# Altium schematic sheet JCM800-2204.SchDoc
size C
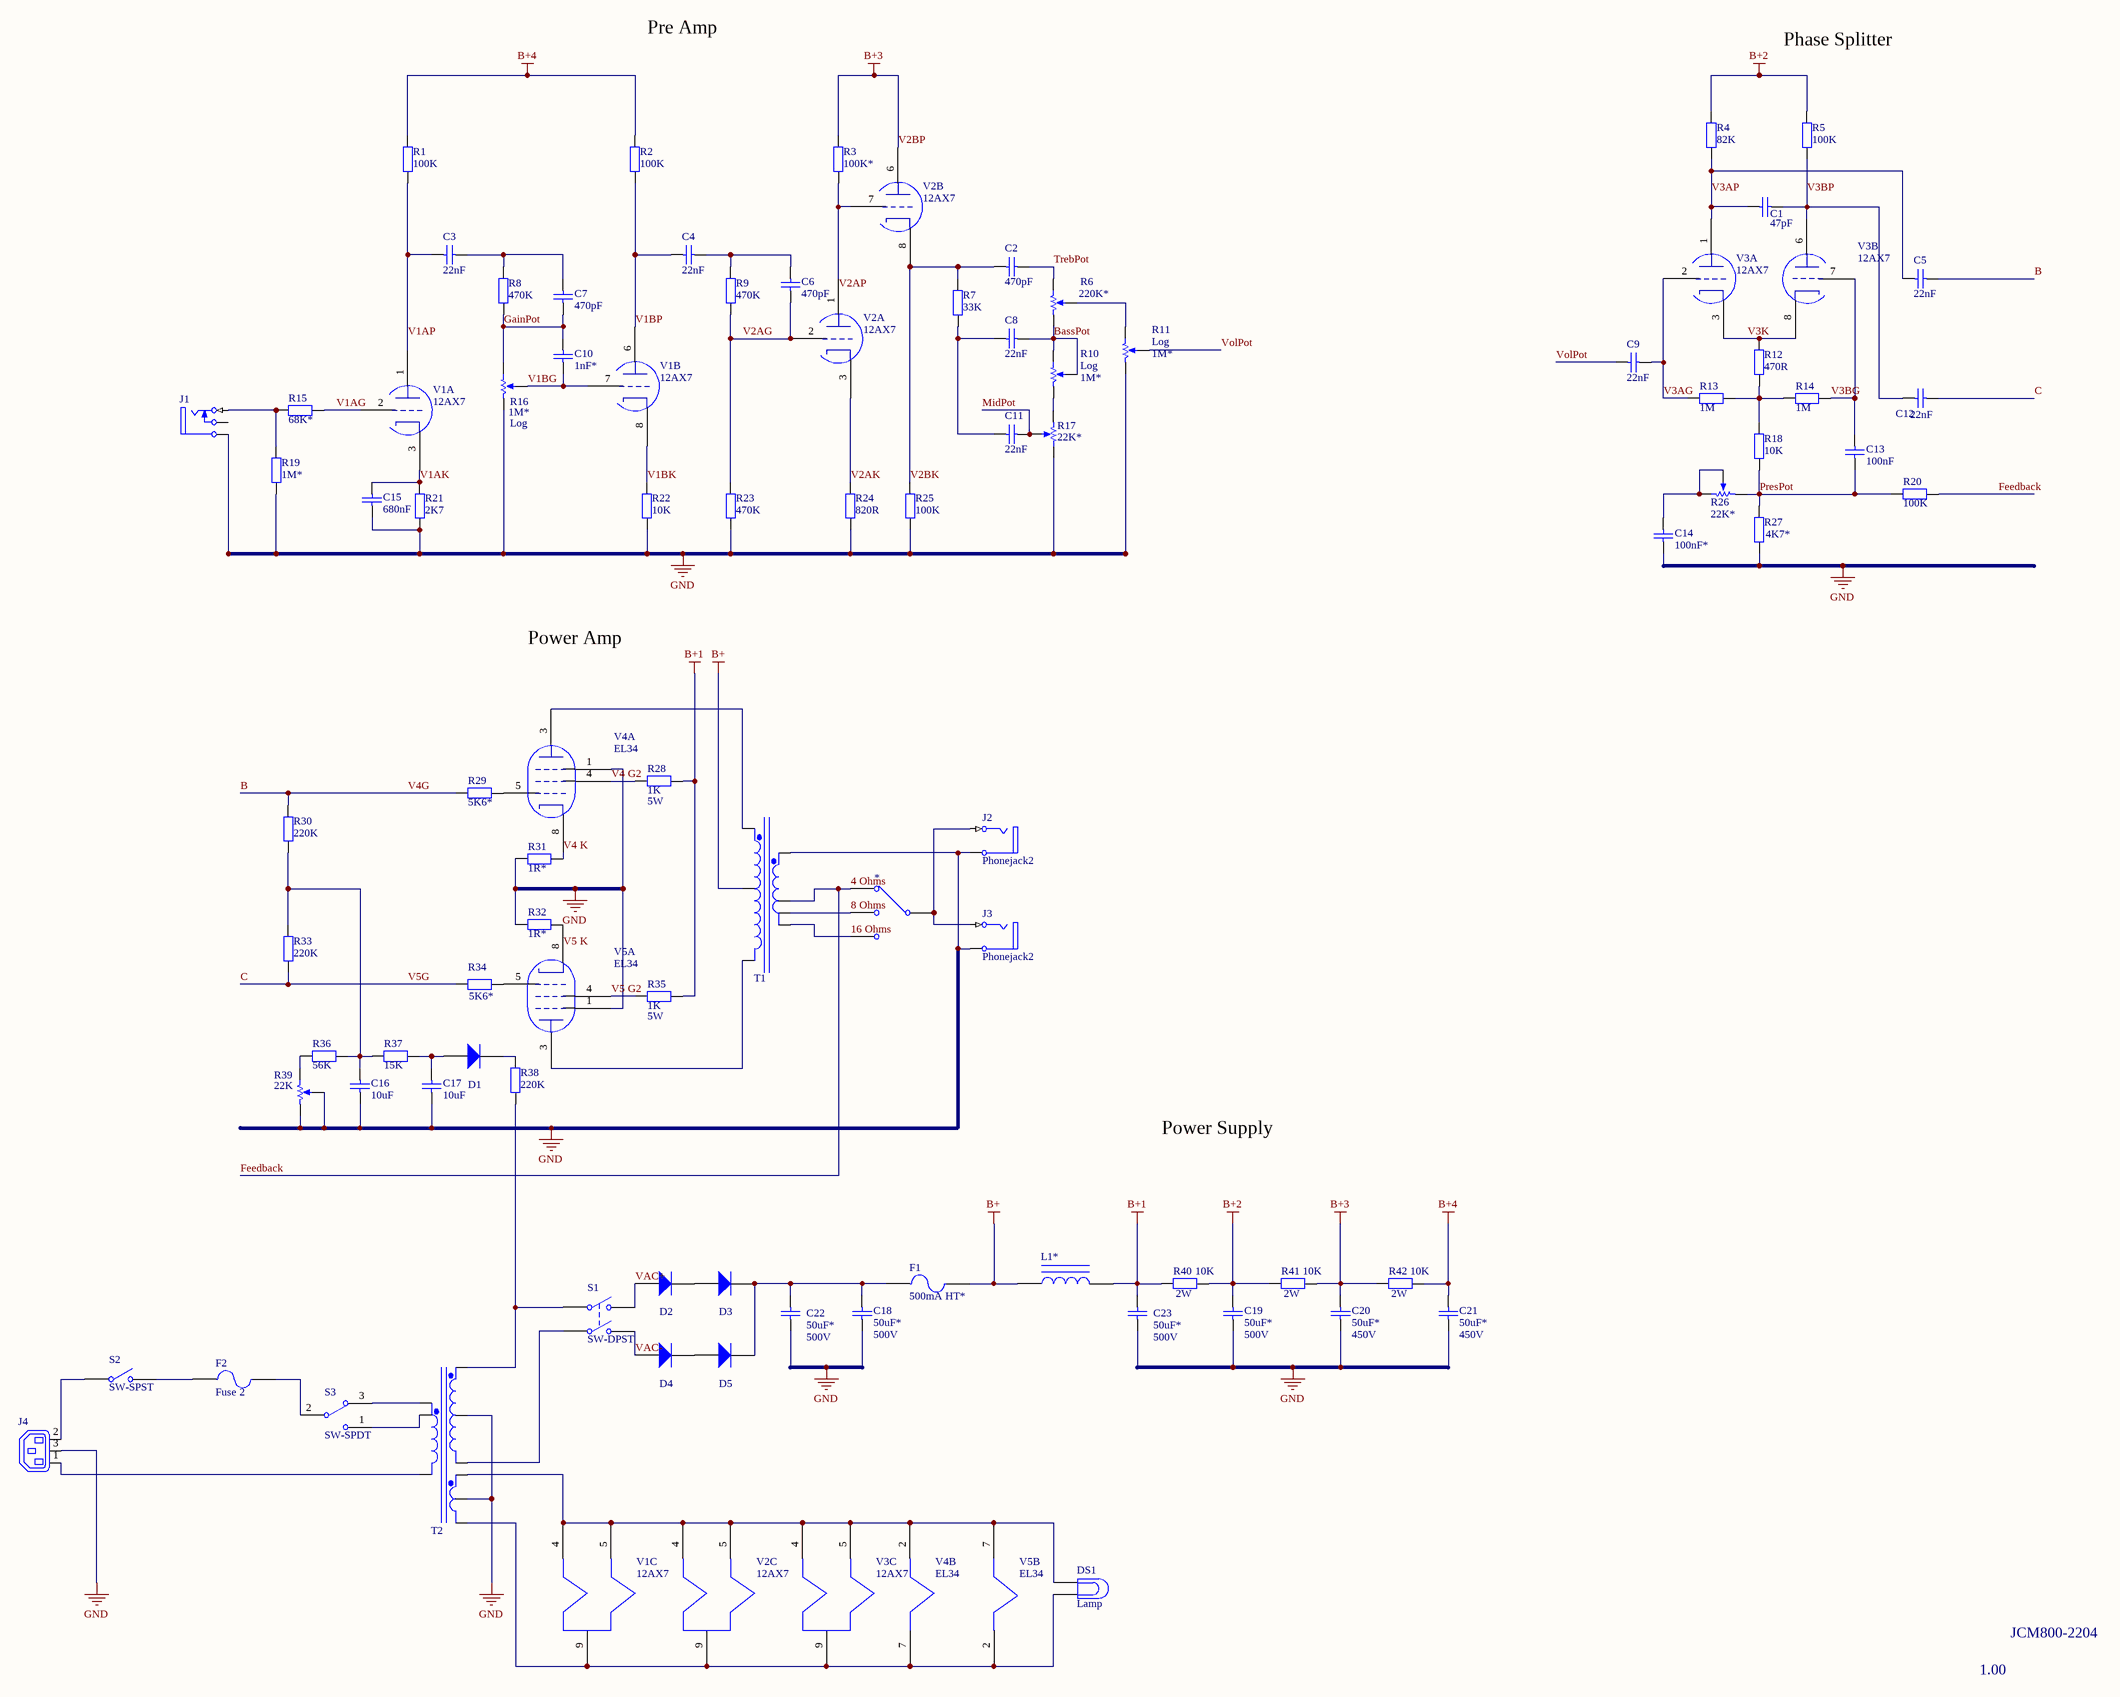
[diagram p0: JCM800-2204.SchDoc]

## Parts
*  Switch 3way  (value not drawn)
C1  value 47pF  [3CM TURRET]  (hidden comment: Cap-cer-RSV-50V-0805)
C2  value 470pF  [6cm Turret]  (hidden comment: Cap-cer-RSV-50V-0805)
C3  value 22nF  [3CM TURRET]  (hidden comment: Cap-cer-RSV-50V-0805)
C4  value 22nF  [3CM TURRET]  (hidden comment: Cap-cer-RSV-50V-0805)
C5  value 22nF  [6CM TURRET]  (hidden comment: Cap-cer-RSV-50V-0805)
C6  value 470pF  (hidden comment: Cap-cer-RSV-50V-0805)
C7  value 470pF  (hidden comment: Cap-cer-RSV-50V-0805)
C8  value 22nF  [6cm Turret]  (hidden comment: Cap-cer-RSV-50V-0805)
C9  value 22nF  [6cm Turret]  (hidden comment: Cap-cer-RSV-50V-0805)
C10  value 1nF*  (hidden comment: Cap-cer-RSV-50V-0805)
C11  value 22nF  [6cm Turret]  (hidden comment: Cap-cer-RSV-50V-0805)
C12  value 22nF  [6CM TURRET]  (hidden comment: Cap-cer-RSV-50V-0805)
C13  value 100nF  [6CM TURRET]  (hidden comment: Cap-cer-RSV-50V-0805)
C14  value 100nF*  (hidden comment: Cap-cer-RSV-50V-0805)
C15  value 680nF  (hidden comment: Cap-cer-RSV-50V-0805)
C16  value 10uF  [6CM TURRET]  (hidden comment: Cap-cer-RSV-50V-0805)
C17  value 10uF  [6CM TURRET]  (hidden comment: Cap-cer-RSV-50V-0805)
C18  value 50uF*  Voltage: 500V  [6cm Turret]  (hidden comment: Cap-cer-RSV-50V-0805)
C19  value 50uF*  Voltage: 500V  [6cm Turret]  (hidden comment: Cap-cer-RSV-50V-0805)
C20  value 50uF*  Voltage: 450V  [6cm Turret]  (hidden comment: Cap-cer-RSV-50V-0805)
C21  value 50uF*  Voltage: 450V  [6cm Turret]  (hidden comment: Cap-cer-RSV-50V-0805)
C22  value 50uF*  Voltage: 500V  (hidden comment: Cap-cer-RSV-50V-0805)
C23  value 50uF*  Voltage: 500V  [6cm Turret]  (hidden comment: Cap-cer-RSV-50V-0805)
D1  1N4148  [3cm Turret]  (value not drawn)
D2  1N4148  [3cm Turret]  (value not drawn)
D3  1N4148  [3cm Turret]  (value not drawn)
D4  1N4148  [3cm Turret]  (value not drawn)
D5  1N4148  [3cm Turret]  (value not drawn)
DS1  Lamp
F1  500mA HT*
F2  Fuse 2
J1  Phonejack2 TN  [JACK/6-V3A]  (value not drawn)
J2  Phonejack2  [JACK/6-V2]
J3  Phonejack2  [JACK/6-V2]
J4  Plug AC Female  (value not drawn)
L1*  Inductor Iron  (value not drawn)
R1  value 100K  [3CM TURRET]  (hidden comment: Res-100K-0805-1%-1/8W)
R2  value 100K  [3CM TURRET]  (hidden comment: Res-100K-0805-1%-1/8W)
R3  value 100K*  (hidden comment: Res-100K-0805-1%-1/8W)
R4  value 82K  [3CM TURRET]  (hidden comment: Res-82K-0805-1%-1/8W)
R5  value 100K  [3CM TURRET]  (hidden comment: Res-100K-0805-1%-1/8W)
R6  value 220K*  (hidden comment: RPot)
R7  value 33K  [3CM TURRET]  (hidden comment: Res-33K-0805-1%-1/8W)
R8  value 470K  [3CM TURRET]  (hidden comment: Res-470K-0805-1%-1/8W)
R9  value 470K  [6CM TURRET]  (hidden comment: Res-470K-0805-1%-1/8W)
R10  Log  value 1M*
R11  Log  value 1M*
R12  value 470R  [3CM TURRET]  (hidden comment: Res-RSV-0805-1%-1/8W)
R13  value 1M  [3CM TURRET]  (hidden comment: Res-1M-0805-1%-1/8W)
R14  value 1M  [3CM TURRET]  (hidden comment: Res-1M-0805-1%-1/8W)
R15  value 68K*  (hidden comment: Res-68K-0805-1%-1/8W)
R16  Log  value 1M*
R17  value 22K*  (hidden comment: RPot)
R18  value 10K  [3CM TURRET]  (hidden comment: Res-10K-0805-1%-1/8W)
R19  value 1M*  (hidden comment: Res-1M-0805-1%-1/8W)
R20  value 100K  [6CM TURRET]  (hidden comment: Res-100K-0805-1%-1/8W)
R21  value 2K7  [6CM TURRET]  (hidden comment: Res-2K7-0805-1%-1/8W)
R22  value 10K  [6CM TURRET]  (hidden comment: Res-10K-0805-1%-1/8W)
R23  value 470K  [6CM TURRET]  (hidden comment: Res-470K-0805-1%-1/8W)
R24  value 820R  [6CM TURRET]  (hidden comment: Res-820R-0805-1%-1/8W)
R25  value 100K  [6CM TURRET]  (hidden comment: Res-100K-0805-1%-1/8W)
R26  value 22K*  (hidden comment: RPot)
R27  value 4K7*  (hidden comment: Res-4K7-0805-1%-1/8W)
R28  value 1K  Watts: 5W  [6cm Turret]  (hidden comment: Res-1K-0805-1%-1/8W)
R29  value 5K6*  (hidden comment: Res-5K6-0805-1%-1/8W)
R30  value 220K  [3CM TURRET]  (hidden comment: Res-150K-0805-1%-1/8W)
R31  value 1R*  (hidden comment: Res-RSV-0805-1%-1/8W)
R32  value 1R*  (hidden comment: Res-RSV-0805-1%-1/8W)
R33  value 220K  [3CM TURRET]  (hidden comment: Res-150K-0805-1%-1/8W)
R34  value 5K6*  (hidden comment: Res-5K6-0805-1%-1/8W)
R35  value 1K  Watts: 5W  [6cm Turret]  (hidden comment: Res-1K-0805-1%-1/8W)
R36  value 56K  [3CM TURRET]  (hidden comment: Res-47K-0805-1%-1/8W)
R37  value 15K  [3CM TURRET]  (hidden comment: Res-15K-0805-1%-1/8W)
R38  value 220K  [3CM TURRET]  (hidden comment: Res-120K-0805-1%-1/8W)
R39  value 22K  [VR5]  (hidden comment: RPot)
R40  value 10K  Watts: 2W  [3cm Turret]  (hidden comment: Res-10K-0805-1%-1/8W)
R41  value 10K  Watts: 2W  [3cm Turret]  (hidden comment: Res-10K-0805-1%-1/8W)
R42  value 10K  Watts: 2W  [3cm Turret]  (hidden comment: Res-10K-0805-1%-1/8W)
S1  SW-DPST
S2  SW-SPST
S3  SW-SPDT
T1  Transformador Saida  (value not drawn)
T2  Transformer  (value not drawn)
V1  12AX7  (parts A,B,C of 3)
V2  12AX7  (parts A,B,C of 3)
V3  12AX7  (parts A,B,C of 3)
V4  EL34  (parts A,B of 2)
V5  EL34  (parts A,B of 2)

## Nets
B+: F1.2 L1*.1 T1.2(Pri-)
B+1: C23.1 L1*.2 R28.2 R35.2 R40.2
B+2: C19.1 R4.2 R5.2 R40.1 R41.2
B+4: C21.1 R1.2 R2.2 R42.1
GND: C14.1 C15.1 C16.2 C17.2 C18.2 C19.2 C20.2 C21.2 C22.2 C23.2 J1.5(S) J2.5(S) J3.5(S) J4.3(E) R11.2(BOT) R16.2(BOT) R17.1(TOP) R19.1 R21.1 R22.1 R23.1 R24.1 R25.1 R27.1 R31.2 R32.2 R39.2(BOT) R39.3(TAP) T1.3(Sec1+) T2.7 T2.8 V4.1(g3) V5.1(g3)
V2BP: C20.1 R3.2 R41.1 R42.2 V2.6(Plate)  [also labelled B+3]
4 Ohms: *.1 R20.1 T1.6(Sec2-)  [also labelled Feedback]
8 Ohms: *.3 T1.5(Sec2+)
16 Ohms: *.1 T1.4(Sec1-)
B: C5.1 R29.1 R30.2  [also labelled V4G]
BassPot: C8.1 R6.2(BOT) R10.1(TOP) R10.3(TAP)
C: C12.1 R33.1 R34.1  [also labelled V5G]
GainPot: C7.2 C10.1 R8.1 R16.1(TOP)
MidPot: C11.1 R17.3(TAP)
PresPot: C13.2 R18.1 R20.2 R26.2(BOT) R27.2
TrebPot: C2.1 R6.1(TOP)
V1AG: R15.2 V1.2(Grid)
V1AK: C15.2 R21.2 V1.3(Cathode)
V1AP: C3.2 R1.1 V1.1(Plate)
V1BG: C10.2 R16.3(TAP) V1.7(Grid)
V1BK: R22.2 V1.8(Cathode)
V1BP: C4.1 R2.1 V1.6(Plate)
V2AG: C6.1 R9.1 R23.2 V2.2(Grid)
V2AK: R24.2 V2.3(Cathode)
V2BK: C2.2 R7.2 R25.2 V2.8(Cathode)
V3AG: C9.1 R13.2 V3.2(Grid)
V3AP: C1.2 C5.2 R4.1 V3.1(Plate)
V3BG: C13.1 R14.1 V3.7(Grid)
V3BP: C1.1 C12.2 R5.1 V3.6(Plate)
V3K: R12.2 V3.3(Cathode) V3.8(Cathode)
V4 G2: R28.1 V4.4(g2)
V4 K: R31.1 V4.8(Cathode)
V5 G2: R35.1 V5.4(g2)
VAC+: D2.1(A) S1.2(NO1)
VAC-: D4.1(A) S1.4(NO2)
VolPot: C9.2 R11.3(TAP)
Net*_2: *.2 J2.1(T) J3.1(T)
NetC3_1: C3.1 C7.1 R8.2
NetC4_2: C4.2 C6.2 R9.2
NetC8_2: C8.2 C11.2 R7.1
NetC14_2: C14.2 R26.1(TOP) R26.3(TAP)
NetC16_1: C16.1 R30.1 R33.2 R36.2 R37.1
NetC17_1: C17.1 D1.1(A) R37.2
NetC18_1: C18.1 C22.1 D3.2(K) D5.2(K) F1.1
NetD1_2: D1.2(K) R38.2
NetD2_2: D2.2(K) D3.1(A)
NetD4_2: D4.2(K) D5.1(A)
NetDS1_1: DS1.1 T2.5(Sec2+) V1.4 V1.5 V2.4 V2.5 V3.4 V3.5 V4.2 V5.7
NetDS1_2: DS1.2 T2.6(Sec2-) V1.9 V2.9 V3.9 V4.7 V5.2
NetF2_1: F2.1 S2.2(NO)
NetF2_2: F2.2 S3.2
NetJ1_1: J1.1(T) R15.1 R19.2
NetJ4_1: J4.1(L) T2.2(Pri-)
NetJ4_2: J4.2(N) S2.1(COMMON)
NetR3_1: R3.1 V2.1(Plate) V2.7(Grid)
NetR6_3: R6.3(TAP) R11.1(TOP)
NetR10_2: R10.2(BOT) R17.2(BOT)
NetR12_1: R12.1 R13.1 R14.2 R18.2
NetR29_2: R29.2 V4.5(g1)
NetR32_1: R32.1 V5.8(Cathode)
NetR34_2: R34.2 V5.5(g1)
NetR36_1: R36.1 R39.1(TOP)
NetR38_1: R38.1 S1.1(COMMON1) T2.3(Sec1+)
NetS1_3: S1.3(COMMON2) T2.4(Sec1-)
NetS3_1: S3.1 T2.1(Pri+)
NetS3_3: S3.3 T2.1(Pri+)
NetT1_1: T1.1(Pri+) V4.3(Plate)
NetT1_2: T1.2(Pri-) V5.3(Plate)

Not connected (* = marked no-connect by the designer): J1 2(TN)

## Notes on the sheet
- Pre Amp
- Phase Splitter
- Power Amp
- Power Supply
- JCM800-2204
- 1.00
- Labels drawn without touching a wire or pin: V2AP, V5 K

## Library data of the parts
C1-C23 = Cap-cer-RSV-50V-0805: Capacitor, ceramic, RSV, 50V, 0805; Part Number: RK-cer-RSV-50V-0805
D1-D5 = Diode-1N4148: Diode; Part Number: RK-Diode-1N4148
DS1 = Lamp: Incandescent Bulb; Published: 24-Mar-1999; LatestRevisionDate: 17-Jul-2002; LatestRevisionNote: Re-released for DXP Platform.; PackageReference: PIN2; Publisher: Altium Limited
F1 F2 = Fuse 2: Fuse; Published: 8-Jun-2000; LatestRevisionDate: 17-Jul-2002; LatestRevisionNote: Re-released for DXP Platform.; PackageReference: PIN-W2/E2.8; Publisher: Altium Limited; PackageDescription: Thru-Hole; 2 Leads
J1 = Phonejack2 TN: Jack Socket, 1/4" [6.5mm], Thru-Hole, Vertical, 2-Conductor with Tip closed; PackageDocument: 2003; PCB_Layout: Complies with manufacturer's recommendation.; DrillAndSlotSize: Corresponds to nominal value.; LatestRevisionDate: 15-Jul-2004; LatestRevisionNote: Component Replaced & renamed from "Phonejack".; DatasheetDocument: 2003; PackageReference: S1VS_SNB; Publisher: Altium Limited; ComponentLink1Description: Manufacturer Link; ComponentLink1URL: http://www.cliffuk.co.uk/
J2 J3 = Phonejack2: Jack Socket, 1/4" [6.5mm], Thru-Hole, Vertical, 2-Conductor Open Circuit; PackageDocument: 2003; PCB_Layout: Complies with manufacturer's recommendation.; DrillAndSlotSize: Corresponds to nominal value.; LatestRevisionDate: 15-Jul-2004; LatestRevisionNote: Component Replaced.; DatasheetDocument: 2003; PackageReference: S1VS_SNS; Publisher: Altium Limited; ComponentLink1Description: Manufacturer Link; ComponentLink1URL: http://www.cliffuk.co.uk/
J4 = Plug AC Female: IEC Mains Power Outlet, EN60 320-2-2 F Class I, PC Flange Rear Mount, Chassis Socket; PackageDocument: ver.80, 15-Sep-2003; MaximumRating: 10A, 250V a.c. (UL & CSA 15A, 250V a.c.); MountingFixtures: Not drawn on schematic symbol.; PCB_Layout: Complies with manufacturer's recommendation.; DrillSize: Corresponds to nominal value.; Published: 15-Jul-2004; LatestRevisionDate: 15-Jul-2004; LatestRevisionNote: Component Replaced & renamed from "Phonejack".; DatasheetDocument: ver.80, 15-Sep-2003; PackageReference: PX0675/PC; Publisher: Altium Limited; Terminations: P.C. Spills; ComponentLink1Description: Manufacturer Link; ComponentLink1URL: http://www.bulgin.co.uk/
L1* = Inductor Iron: Magnetic-Core Inductor; Value: 10mH; Published: 24-Mar-1999; LatestRevisionDate: 17-Jul-2002; LatestRevisionNote: Re-released for DXP Platform.; PackageReference: AXIAL-0.9; Publisher: Altium Limited; PackageDescription: Axial Device, Thru-Hole; 2 Leads; 0.9 in Pin Spacing
R1-R3 R5 R20 R25 = Res-100K-0805-1%-1/8W: Resistor, 100K, 0805, 1%, 1/8W; Part Number: RK-100K-0805-1%-1/8W
R4 = Res-82K-0805-1%-1/8W: Resistor, 82K, 0805, 1%, 1/8W; Part Number: RK-82K-0805-1%-1/8W
R6 R10 R11 R16 R17 R26 R39 = RPot: Potentiometer; Sim Note: Enter the Resistance value and the set point into parameter fields.; Set Position: 0.5; Published: 8-Jun-2000; LatestRevisionDate: 17-Jul-2002; LatestRevisionNote: Re-released for DXP Platform.; PackageReference: VR5; Publisher: Altium Limited; PackageDescription: Variable Resistor, Thru-Hole; 3 Leads
R7 = Res-33K-0805-1%-1/8W: Resistor, 33K, 0805, 1%, 1/8W; Part Number: RK-33K-0805-1%-1/8W
R8 R9 R23 = Res-470K-0805-1%-1/8W: Resistor, 470K, 0805, 1%, 1/8W; Part Number: RK-470K-0805-1%-1/8W
R12 R31 R32 = Res-RSV-0805-1%-1/8W: Resistor, RSV, 0805, 1%, 1/8W; Part Number: RK-RSV-0805-1%-1/8W
R13 R14 R19 = Res-1M-0805-1%-1/8W: Resistor, 1M, 0805, 1%, 1/8W; Part Number: RK-1M-0805-1%-1/8W
R15 = Res-68K-0805-1%-1/8W: Resistor, 68K, 0805, 1%, 1/8W; Part Number: RK-68K-0805-1%-1/8W
R18 R22 R40-R42 = Res-10K-0805-1%-1/8W: Resistor, 10K, 0805, 1%, 1/8W; Part Number: RK-10K-0805-1%-1/8W
R21 = Res-2K7-0805-1%-1/8W: Resistor, 2K7, 0805, 1%, 1/8W; Part Number: RK-2K7-0805-1%-1/8W
R24 = Res-820R-0805-1%-1/8W: Resistor, 820R, 0805, 1%, 1/8W; Part Number: RK-820R-0805-1%-1/8W
R27 = Res-4K7-0805-1%-1/8W: Resistor, 4K7, 0805, 1%, 1/8W; Part Number: RK-4K7-0805-1%-1/8W
R28 R35 = Res-1K-0805-1%-1/8W: Resistor, 1K, 0805, 1%, 1/8W; Part Number: RK-1K-0805-1%-1/8W
R29 R34 = Res-5K6-0805-1%-1/8W: Resistor, 5K6, 0805, 1%, 1/8W; Part Number: RK-5K6-0805-1%-1/8W
R30 R33 = Res-150K-0805-1%-1/8W: Resistor, 150K, 0805, 1%, 1/8W; Part Number: RK-150K-0805-1%-1/8W
R36 = Res-47K-0805-1%-1/8W: Resistor, 47K, 0805, 1%, 1/8W; Part Number: RK-47K-0805-1%-1/8W
R37 = Res-15K-0805-1%-1/8W: Resistor, 15K, 0805, 1%, 1/8W; Part Number: RK-15K-0805-1%-1/8W
R38 = Res-120K-0805-1%-1/8W: Resistor, 120K, 0805, 1%, 1/8W; Part Number: RK-120K-0805-1%-1/8W
S1 = SW-DPST: Double-Pole, Single-Throw Switch; Published: 24-Mar-1999; LatestRevisionDate: 17-Jul-2002; LatestRevisionNote: Re-released for DXP Platform.; PackageReference: DPST-4; Publisher: Altium Limited; PackageDescription: Switch; 4 Leads
S2 = SW-SPST: Single-Pole, Single-Throw Switch; Published: 24-Mar-1999; LatestRevisionDate: 17-Jul-2002; LatestRevisionNote: Re-released for DXP Platform.; PackageReference: SPST-2; Publisher: Altium Limited; PackageDescription: Switch; 2 Leads
S3 = SW-SPDT: SPDT Subminiature Toggle Switch, Right Angle Mounting, Vertical Actuation; Published: 24-Mar-1999; LatestRevisionDate: 17-Dec-2003; LatestRevisionNote: Schematic revised, PCB Footprint replaced.; DatasheetVersion: 05-Dec-2000; PackageReference: TL36WW15050; Publisher: Altium Limited; PackageDescription: Switch; 4 Leads; ComponentLink1Description: Manufacturer Link; ComponentLink1URL: http://www.apem.com
V1-V3 = 12AX7: Tube